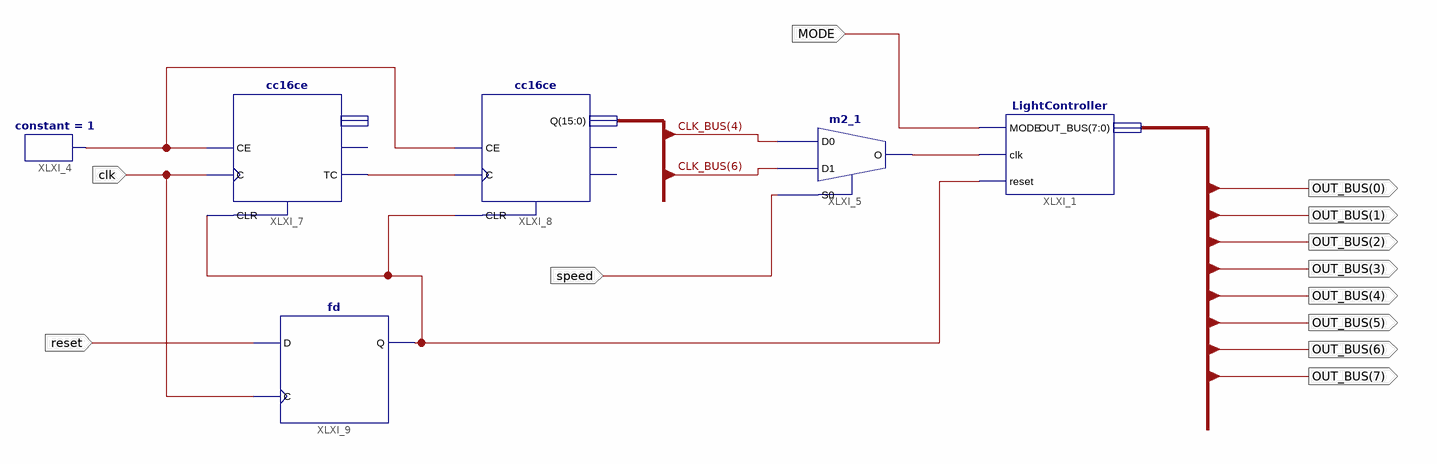
[diagram p0: schematic sheet 1]
// Xilinx ISE schematic TopLevel.sch (spartan3a) as structural Verilog: 6 symbols, 12 ports
module TopLevel (
  input  clk,
  input  MODE,
  input  reset,
  input  speed,
  output [7:0] OUT_BUS
);

  wire XLXN_1, XLXN_15, XLXN_17, XLXN_27;
  wire [15:0] CLK_BUS;

  LightController XLXI_1 (.MODE(MODE), .clk(XLXN_15), .reset(XLXN_27), .OUT_BUS(OUT_BUS));
  constant #(.CValue("1")) XLXI_4 (.O(XLXN_1));
  m2_1 XLXI_5 (.D0(CLK_BUS[4]), .D1(CLK_BUS[6]), .S0(speed), .O(XLXN_15));
  cc16ce XLXI_7 (.C(clk), .CE(XLXN_1), .CLR(XLXN_27), .TC(XLXN_17));  // open: CEO, Q
  cc16ce XLXI_8 (.C(XLXN_17), .CE(XLXN_1), .CLR(XLXN_27), .Q(CLK_BUS));  // open: CEO, TC
  fd XLXI_9 (.C(clk), .D(reset), .Q(XLXN_27));
endmodule
